# Altium schematic sheet Power.SchDoc
size A4; SheetNumber: 5; SheetTotal: 8
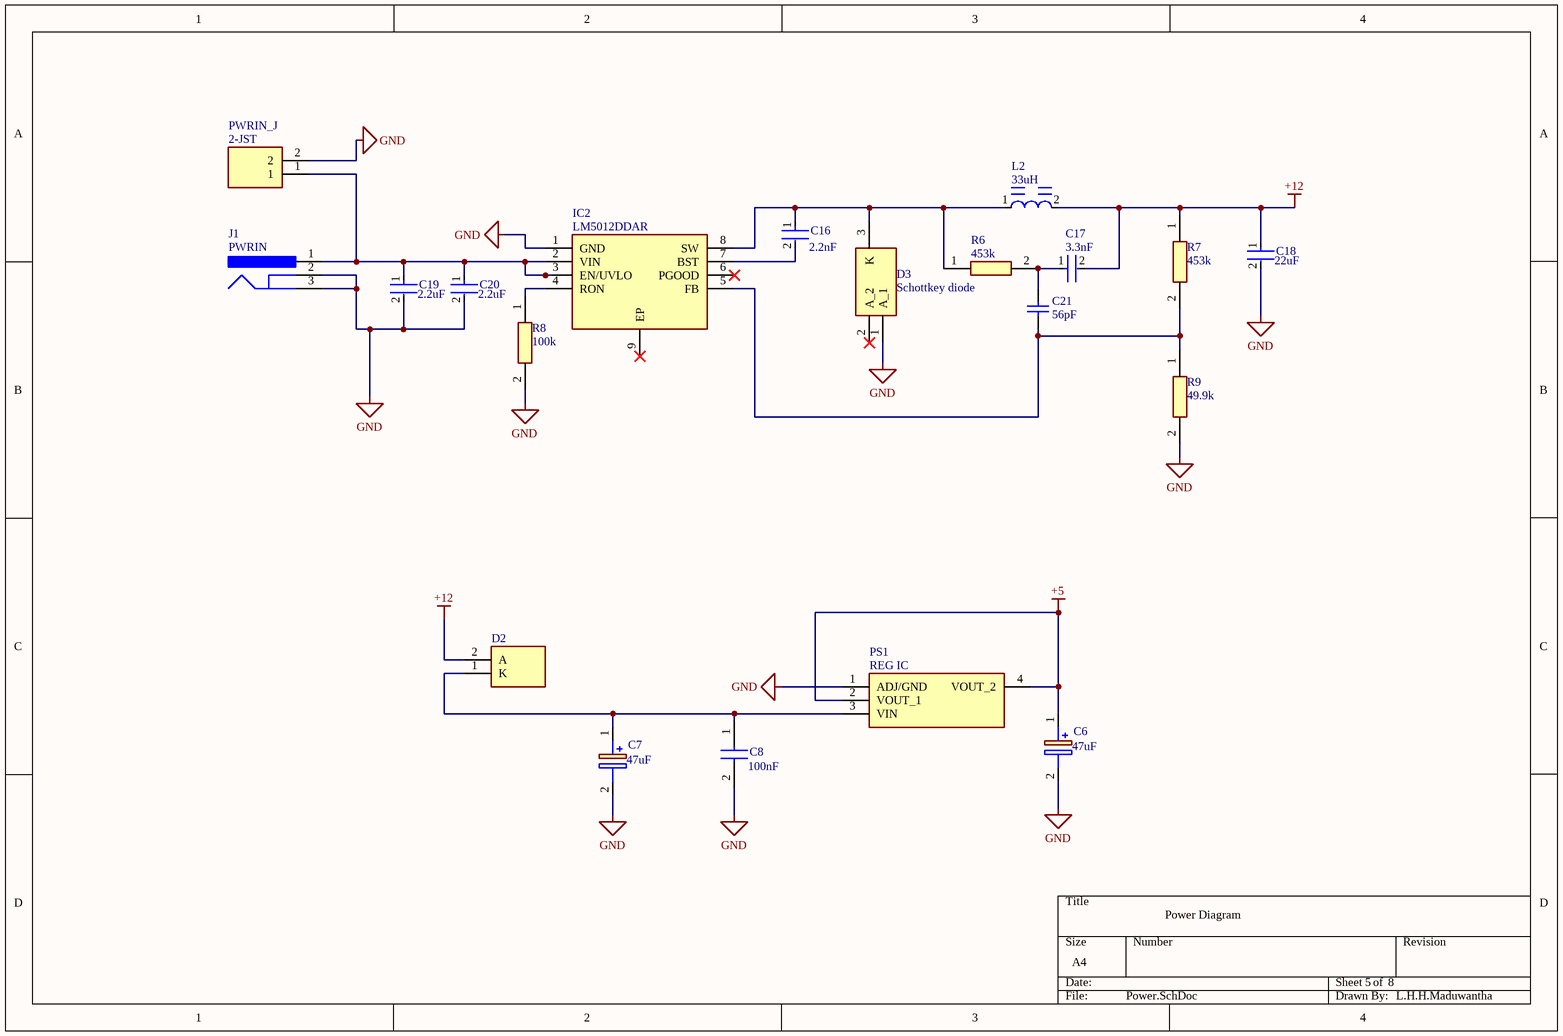
[diagram p0: Power.SchDoc]

## Parts
C6  value 47uF  [EEE1AA101SP]  (hidden comment: EEE-1EA470WP)
C7  value 47uF  [EEE1AA101SP]  (hidden comment: EEE-1EA470WP)
C8  Capacitance: 100nF  [C0603]  (hidden comment: C0603C104K5RAC3190)
C16  Capacitance: 2.2nF  [FP-GRM155-0_05-IPC_C]  (hidden comment: GRM155R71H222JA01D)
C17  Capacitance: 3.3nF  [FP-1206-L_3_2_0_2-W_1_6_0-IPC_C]  (hidden comment: 12065C332KAT2A)
C18  Capacitance: 22uF  [FP-GRM21B-0_15-MFG]  (hidden comment: GRM21BR60J226ME39L)
C19  Capacitance: 2.2uF  [FP-GCM31C-0_2-e0_3_0_8-MFG]  (hidden comment: GCM31CR71H225KA55K)
C20  Capacitance: 2.2uF  [FP-GCM31C-0_2-e0_3_0_8-MFG]  (hidden comment: GCM31CR71H225KA55K)
C21  Capacitance: 56pF  [CAPC0603X33X15ML03T05]  (hidden comment: 02015C560KAT2A)
D2  CGRA4007-G  [DIOM5127X229N]  (value not drawn)
D3  Name: Schottkey diode  [V8P12M386A]  (hidden comment: V8P12-M3_86A)
IC2  LM5012DDAR  [SOIC127P600X170-9N]
J1  NAME: PWRIN  [CUI-PJ-102BH_V]  (hidden comment: PJ-102BH)
L2  Inductance: 33uH  [FP-SRR1280-MFG]  (hidden comment: SRR1280-330M)
PS1  NAME: REG IC  [SOT230P700X170-4N]  (hidden comment: SPX1117M3-L-5-0_TR)
PWRIN_J  Name: 2-JST  [B2BXHAMLFSN]  (hidden comment: B2B-XH-AM_LF__SN_)
R6  Resistance: 453k  [ERJS1T_U1T_(2512)]  (hidden comment: ERJ-S1TD4533U)
R7  Resistance: 453k  [ERJS1T_U1T_(2512)]  (hidden comment: ERJ-S1TD4533U)
R8  Resistance: 100k  [RESC7142X120N]  (hidden comment: 3540100KJT)
R9  Resistor: 49.9k  [RESC6332X70N]  (hidden comment: CRCW251249K9FKEG)

## Nets
+5: C6.1(+) PS1.2(VOUT_1) PS1.4(VOUT_2)
+12: C17.2 C18.1 D2.2(A) L2.2 R7.1
GND: C6.2(-) C7.2(-) C8.2 C18.2 C19.2 C20.2 D3.1(A_1) IC2.1(GND) J1.2 J1.3 PS1.1(ADJ/GND) PWRIN_J.2 R8.2 R9.2
NetC7_1: C7.1(+) C8.1 D2.1(K) PS1.3(VIN)
NetC16_1: C16.1 D3.3(K) IC2.8(SW) L2.1 R6.1
NetC16_2: C16.2 IC2.7(BST)
NetC17_1: C17.1 C21.2 R6.2
NetC19_1: C19.1 C20.1 IC2.2(VIN) IC2.3(EN/UVLO) J1.1 PWRIN_J.1
NetC21_1: C21.1 IC2.5(FB) R7.2 R9.1
NetIC2_4: IC2.4(RON) R8.1

Not connected (* = marked no-connect by the designer): D3 2(A_2)*; IC2 6(PGOOD)* 9(EP)*

## Notes on the sheet
- Power Diagram
- L.H.H.Maduwantha

## Library data of the parts
C6 C7 = EEE-1EA470WP: Capacitor Polarised; Manufacturer_Name: Panasonic; Voltage: 25V; Datasheet Link: http://industrial.panasonic.com/cdbs/www-data/pdf/RDE0000/ABA0000C1145.pdf; Height: 7.8mm; Manufacturer_Part_Number: EEE-1EA470WP; Mouser Part Number: 667-EEE-1EA470WP; Mouser Price/Stock: https://www.mouser.co.uk/ProductDetail/Panasonic/EEE-1EA470WP?qs=ANJC8C65Mw4aAM55A7BE%2Fw%3D%3D; Arrow Part Number: EEE-1EA470WP; Arrow Price/Stock: https://www.arrow.com/en/products/eee-1ea470wp/panasonic?region=nac
C8 = C0603C104K5RAC3190: Capacitor; Manufacturer_Name: KEMET; Datasheet Link: https://content.kemet.com/datasheets/KEM_C1023_X7R_AUTO_SMD.pdf; Height: 0.87mm; Manufacturer_Part_Number: C0603C104K5RAC3190; Mouser Part Number: 80-C0603C104K5R3190; Mouser Price/Stock: https://www.mouser.co.uk/ProductDetail/KEMET/C0603C104K5RAC3190?qs=OycAS1CGnljhMsmpVYrMLA%3D%3D; Arrow Part Number: C0603C104K5RAC3190; Arrow Price/Stock: https://www.arrow.com/en/products/c0603c104k5rac3190/kemet-corporation?region=nac
C16 = CMP-2008-04651-2: Chip Multilayer Ceramic Capacitors for General Purpose, 0402, 2200pF, X7R, 15%, 5%, 50V; Max Operating Temperature: 125°C; Tolerance: 5%; Voltage: 50V; Height: 0.5mm; Min Operating Temperature: -55°C; Lead Free: Lead Free; Voltage Rating (DC): 50V; Package Quantity: 10000; Voltage Rating: 50V; Depth: 0.5mm; Mount: Surface Mount; Termination: SMD/SMT; Radiation Hardening: No; Case Code (Imperial): 0402; Case/Package: 0402; Case Code (Metric): 1005; Thickness: 0.022inch; Dielectric: X7R; Width: 0.02inch; Packaging: Tape and Reel; Length: 1mm
C17 = CMP-04427-015080-1: General Purpose Ceramic Capacitor, 1206, 3.3nF, 10%, X7R, 15%, 50V; Dissipation Factor: 2.5%; Package Quantity: 1; Voltage Rating (DC): 50V; REACH SVHC: No SVHC; Lead Free: Lead Free; Min Operating Temperature: -55°C; Voltage Rating: 50V; Max Operating Temperature: 125°C; Thickness: 0.037inch; Case/Package: 1206; Height: 0.94mm; Mount: Surface Mount; Contact Plating: Tin; Voltage: 50V; Construction: Flat; Length: 3.2mm; Case Code (Imperial): 1206; Dielectric Material: Ceramic; Dielectric: X7R; Tolerance: 10%; Case Code (Metric): 3216; Number of Pins: 2; Depth: 1.6mm; Series: -; Width: 1.6mm; Packaging: Tape and Reel; RoHS Compliant: Yes; Termination: SMD/SMT
C18 = CMP-2007-03385-2: Chip Multilayer Ceramic Capacitors for General Purpose, 0805, 22uF, X5R, 15%, 20%, 6.3V; Material: Ceramic; Max Operating Temperature: 85°C; Voltage: 6.3V; Min Operating Temperature: -55°C; Case/Package: 0805; Thickness: 0.053inch; Dielectric: X5R; Packaging: Tape and Reel; Depth: 1.25mm; Termination: SMD/SMT; Voltage Rating (DC): 6.3V; Radiation Hardening: No; Tolerance: 20%; Mount: Surface Mount; Lead Free: Lead Free; Package Quantity: 1; REACH SVHC: No SVHC; Voltage Rating: 6.3V; Length: 2mm; Case Code (Imperial): 0805; Case Code (Metric): 2012; Width: 0.049inch; Height: 1.25mm
C19 C20 = CMP-06035-059276-1: Ceramic Capacitor for Automotive 2.2uF ±10% 50VDC X7R 1206 Embossed T/R; Voltage Rating (DC): 50V; Thickness: 0.071inch; Width: 0.063inch; Length: 3.2mm; Min Operating Temperature: -55°C; Case Code (Metric): 3216; Height: 1.6mm; Voltage Rating: 50V; Packaging: Tape and Reel; Max Operating Temperature: 125°C; Dielectric: X7R; Depth: 1.6mm; Tolerance: 10%; Case Code (Imperial): 1206; Case/Package: 1206; Lead Free: Lead Free; Package Quantity: 6000; Termination: SMD/SMT; Ratings: AEC-Q200; Mount: Surface Mount; Radiation Hardening: No
C21 = CMP-2010-00470-1: Manufacturer: AVX Interconnect / Elco; Part Number: 02015C560KAT2A
D2 = CGRA4007-G: Integrated Circuit; Manufacturer_Name: Comchip Technology; Datasheet Link: http://www.mouser.com/datasheet/2/80/CGRA4001-G_Thru647977._CGRA4007-G_RevE-1481051.pdf; Height: 2.29mm; Manufacturer_Part_Number: CGRA4007-G; Mouser Part Number: 750-CGRA4007-G; Mouser Price/Stock: https://www.mouser.co.uk/ProductDetail/Comchip-Technology/CGRA4007-G?qs=tw%252BuQ%2FB6PO1Jgp22ji8v0g%3D%3D; Arrow Part Number: CGRA4007-G; Arrow Price/Stock: https://www.arrow.com/en/products/cgra4007-g/comchip-technology
D3 = V8P12-M3_86A: Diode; Manufacturer_Name: Vishay; Manufacturer_Part_Number: V8P12-M3/86A; Datasheet Link: https://www.vishay.com/docs/89170/v8p12.pdf; Height: 1.2mm; Mouser Part Number: 78-V8P12-M3/86A; Mouser Price/Stock: https://www.mouser.co.uk/ProductDetail/Vishay-General-Semiconductor/V8P12-M3-86A?qs=HSPD0Bff7iYR%2FGS73JOLOg%3D%3D; Arrow Part Number: V8P12-M3/86A; Arrow Price/Stock: https://www.arrow.com/en/products/v8p12-m386a/vishay?region=nac
IC2 = LM5012DDAR: Integrated Circuit; Manufacturer_Name: Texas Instruments; Datasheet Link: https://www.ti.com/lit/ds/symlink/lm5012.pdf?ts=1682242115443&ref_url=https%253A%252F%252Fwww.ti.com%252Fproduct%252FLM5012; Height: 1.7mm; Manufacturer_Part_Number: LM5012DDAR; Mouser Part Number: 595-LM5012DDAR; Mouser Price/Stock: https://www.mouser.co.uk/ProductDetail/Texas-Instruments/LM5012DDAR?qs=T%252BzbugeAwjjzO1eNFM2OsQ%3D%3D; Arrow Part Number: LM5012DDAR; Arrow Price/Stock: https://www.arrow.com/en/products/lm5012ddar/texas-instruments?region=nac
J1 = CMP-2000-06901-1: Through Hole Right Angle DC Power Jack, 5 A, 2.5 mm Center Pin, 3 Position, -25 to 85 degC, RoHS, Bulk; Manufacturer: CUIInc.; Outside Contact Diameter: 6.5mm; Current Rating: 5A; Brand: CUI; Insulation Resistance: 100MOhms; Inside Contact Diameter: 2.5mm; Voltage Rating: 24V; Operating Temperature Range: -25Cto+85C; Mounting Angle: Right; Mounting Technology: ThroughHole; Product Category: DCPowerConnectors; Datasheet Version: Rev. 1.02, 05/2016; Connector Type: DCPowerJack; Contact Material: Copper; Housing Material: PolybutyleneTerephthalate(PBT); Mounting Style: ThroughHole; Product: Jacks; Package Reference: PJ-102BH; Manufacturer URL: http://www.cui.com/; RoHS: True; Contact Gender: Male; Contact Plating: Nickel; Flammability Rating: UL94V-0; Factory Pack Quantity: 280; Datasheet URL: http://www.cui.com/product/resource/pj-102bh.pdf; Package Description: 3-Pin Through Hole Device, Body 14.4 x 9 mm, Height 11 mm; Termination Style: ThroughHole
L2 = CMP-2000-07148-2: FIXED IND 33UH 3.5A 57 MOHM SMD; Self Resonant Frequency: 9.5MHz; Saturation Current: 3.3A; Shielding: Shielded; Test Frequency: 100kHz; Core Material: Ferrite; Tolerance: 20%; Q Factor: 28; Resistance: 57MR; Material: Steel; RMS Current (Irms): 3.5A; Max DC Current: 3.5A; Height: 7.5mm; Frequency: 9.5MHz; Series: SRR1280; Length: 12.5mm; Military Standard: Not; Height - Seated (Max): 0.315inch; REACH SVHC: No SVHC; DC Current: 3.5A; Current Rating: 3.5A; Sample Rate (Hz): 100kHz; Min Operating Temperature: -40°C; RoHS Compliant: Yes; Width: 12.5mm; Packaging: Tape and Reel; Inductance Tolerance: 20%; Case/Package: Nonstandard; Radiation Hardening: No; Max Operating Temperature: 125°C; Number of Pins: 2; Depth: 12.8mm; Mount: Surface Mount; Termination: SMD/SMT; Package Quantity: 400; DC Resistance (DCR): 57mR; Resistor Type: Wirewound
PS1 = SPX1117M3-L-5-0_TR: Power Supply; Manufacturer_Name: EXAR; Manufacturer_Part_Number: SPX1117M3-L-5-0/TR; Datasheet Link: https://datasheet.datasheetarchive.com/originals/distributors/Datasheets-DGA25/1769206.pdf; Height: 1.7mm; Mouser Part Number: 701-SPX1117M3-L-50TR; Mouser Price/Stock: https://www.mouser.com/Search/Refine.aspx?Keyword=701-SPX1117M3-L-50TR; Arrow Part Number: SPX1117M3-L-5-0/TR; Arrow Price/Stock: https://www.arrow.com/en/products/spx1117m3-l-5-0tr/exar
PWRIN_J = B2B-XH-AM_LF__SN_: Connector; Manufacturer_Name: JST (JAPAN SOLDERLESS TERMINALS); Manufacturer_Part_Number: B2B-XH-AM(LF)(SN); Datasheet Link: https://www.jst-mfg.com/product/pdf/eng/eXH.pdf; Height: 7mm; Arrow Part Number: B2B-XH-AM(LF)(SN); Arrow Price/Stock: https://www.arrow.com/en/products/b2b-xh-am-lf-sn/jst-manufacturing?region=europe
R6 R7 = ERJ-S1TD4533U: Resistor; Manufacturer_Name: Panasonic; Datasheet Link: https://industrial.panasonic.com/cdbs/www-data/pdf/RDP0000/AOA0000C334.pdf; Height: 0.7mm; Manufacturer_Part_Number: ERJ-S1TD4533U
R8 = 3540100KJT: Resistor; Manufacturer_Name: TE Connectivity; Datasheet Link: https://www.te.com/commerce/DocumentDelivery/DDEController?Action=srchrtrv&DocNm=1773204-5&DocType=Data%20Sheet&DocLang=English&PartCntxt=3-2176402-2&DocFormat=pdf; Height: 1.2mm; Manufacturer_Part_Number: 3540100KJT
R9 = CRCW251249K9FKEG: Resistor; Manufacturer_Name: Vishay; Datasheet Link: http://www.vishay.com/docs/20035/dcrcwe3.pdf; Height: 0.7mm; Manufacturer_Part_Number: CRCW251249K9FKEG; Mouser Part Number: 71-CRCW2512-49.9K-E3; Mouser Price/Stock: https://www.mouser.com/Search/Refine.aspx?Keyword=71-CRCW2512-49.9K-E3